# EAGLE schematic side panel V5 (EAGLE 7.6.0)
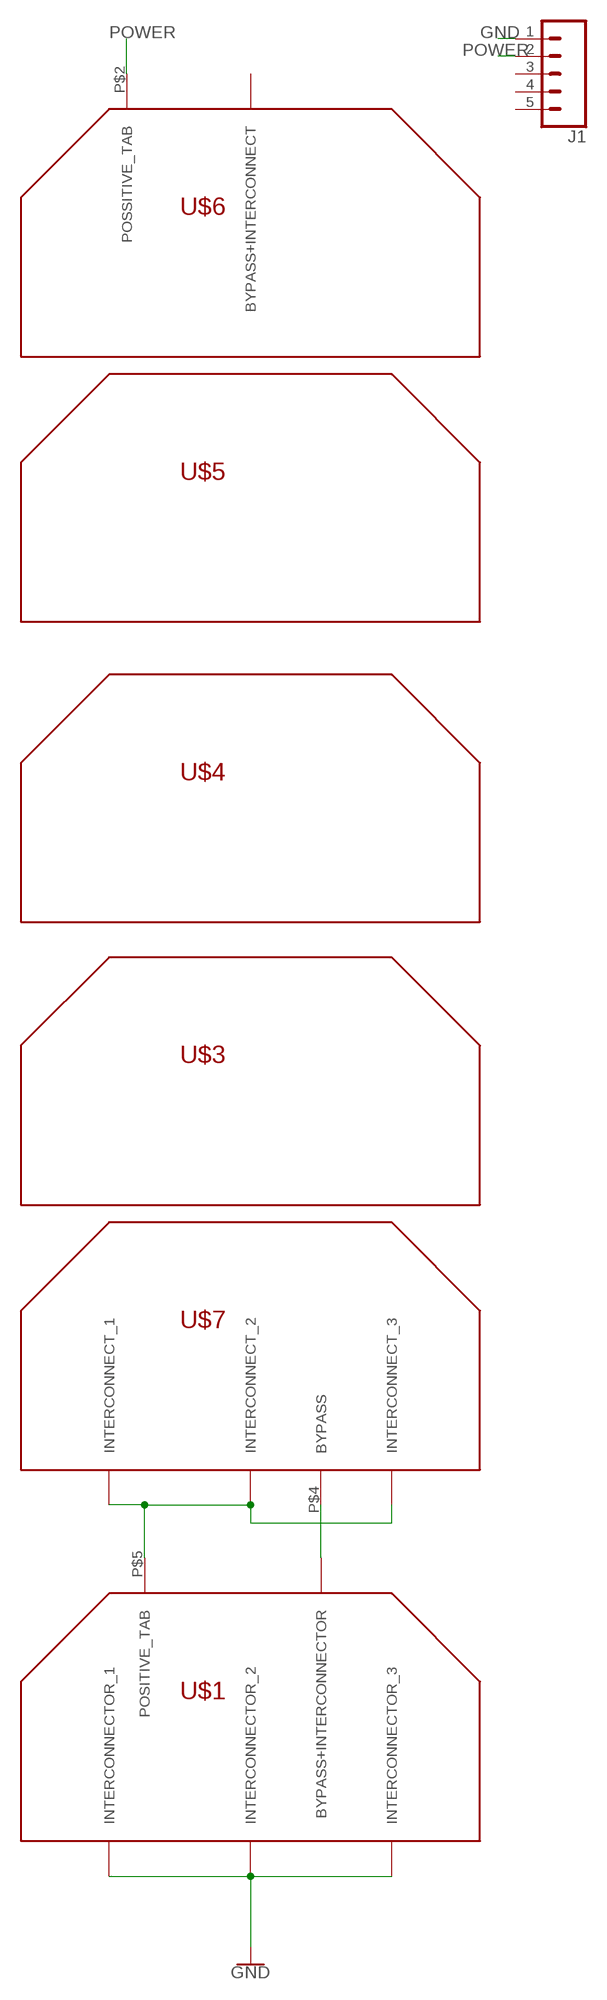
[diagram p0: schematic, sheet 1]

## Parts
J1  CONN_05LOCK  [1X05_LOCK]
U$1  SOLAR_CELL_STAND-ALONE  [SOLAR_CELL_STAND-ALONE]
U$3  SOALAR_CELL_OUTLINE  [SOLAR_CELL_OUTLINE]
U$4  SOALAR_CELL_OUTLINE  [SOLAR_CELL_OUTLINE]
U$5  SOALAR_CELL_OUTLINE  [SOLAR_CELL_OUTLINE]
U$6  SOLAR_CELL_TOP  [SOLAR_CELL_TOP_SHORT-PAD]
U$7  SOLAR_CELL_BOTTOM+BYPASS  [SOLAR_CELL_BOTTOM+BYPASS]

## Nets
GND: J1.1 U$1.P$1(INTERCONNECTOR_1) U$1.P$2(INTERCONNECTOR_2) U$1.P$3(INTERCONNECTOR_3)
N$9: U$1.P$4(BYPASS+INTERCONNECTOR) U$7.P$4(BYPASS)
N$10: U$1.P$5(POSITIVE_TAB) U$7.P$1(INTERCONNECT_1) U$7.P$2(INTERCONNECT_2) U$7.P$3(INTERCONNECT_3)
POWER: J1.2 U$6.P$2(POSSITIVE_TAB)
Unconnected: J1.3 J1.4 J1.5 U$6.P$1(BYPASS+INTERCONNECT)

## Library data of the parts
J1 = SparkFun-Connectors:CONN_05: Multi connection point. Often used as Generic Header-pin footprint for 0.1 inch spaced/style header connections On any of the 0.1 inch spaced packages, you can populate with these: Break Away Headers - Straight <https://www.sparkfun.com/products/116> (PRT-00116) Break Away Male Headers - Right Angle <https://www.sparkfun.com/products/553> (PRT-00553) Female Headers <https://www.sparkfun.com/products/115> (PRT-00115) Break Away Headers - Machine Pin <https://www.sparkfun.com/products/117> (PRT-00117) Break Away Female Headers - Swiss Machine Pin <https://www.sparkfun.com/products/743> (PRT-00743) For SCREWTERMINALS and SPRING TERMINALS visit here: Screw Terimnals on SparkFun.com <https://www.sparkfun.com/search/results?term=Screw+Terminals> (5mm/3.5mm/2.54mm spacing) This device is also useful as a general connection point to wire up your design to another part of your project. Our various solder wires solder well into these plated through hole pads. Hook-Up Wire - Assortment (Stranded, 22 AWG) <https://www.sparkfun.com/products/11375> (PRT-11375) Hook-Up Wire - Assortment (Solid Core, 22 AWG) <https://www.sparkfun.com/products/11367> (PRT-11367) View the entire wire category on our website here <https://www.sparkfun.com/categories/141> Special notes: Molex polarized connector foot print use with SKU : PRT-08231 with associated crimp pins and housings. 1MM SMD Version SKU: PRT-10208
U$1 = DubSat1 Components:SOLAR_CELL_STAND-ALONE
U$3-U$5 = DubSat1 Components:SOALAR_CELL_OUTLINE: Azurspace Solar Cell: http://www.azurspace.com/images/products/0003401-01-01_DB_3G30A.pdf Contains an outline of the solar cell without any pads because the interconnectors will be attached externaly and not on the board. This footprint is to be used as the center cells in a string of cells.
U$6 = DubSat1 Components:SOLAR_CELL_TOP: Azurspace solar cell: http://www.azurspace.com/images/products/0003401-01-01_DB_3G30A.pdf With outline of full cell + pad for top side introconnector and integrated bypass diode. To be used as the top cell in a string of cells.
U$7 = DubSat1 Components:SOLAR_CELL_BOTTOM+BYPASS